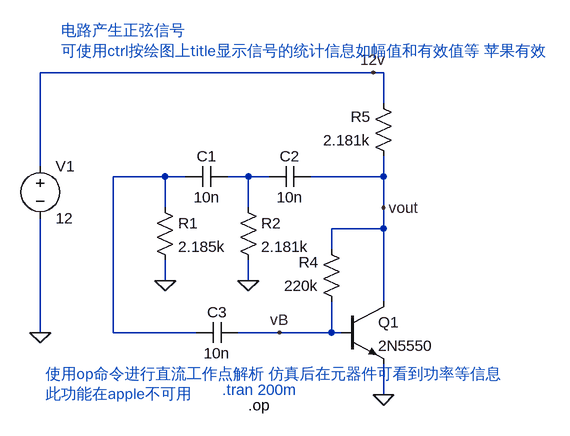
[diagram p0: schematic Draft1.asc]
Draft1.asc, the LTspice schematic file:
Version 4.1
SHEET 1 1076 680
WIRE 800 48 288 48
WIRE 816 48 800 48
WIRE 816 96 816 48
WIRE 288 192 288 48
WIRE 480 208 400 208
WIRE 512 208 480 208
WIRE 608 208 576 208
WIRE 640 208 608 208
WIRE 816 208 816 176
WIRE 816 208 704 208
WIRE 480 256 480 208
WIRE 608 256 608 208
WIRE 816 256 816 208
WIRE 816 288 816 256
WIRE 816 288 736 288
WIRE 736 320 736 288
WIRE 480 368 480 336
WIRE 608 368 608 336
WIRE 816 400 816 288
WIRE 288 448 288 272
WIRE 400 448 400 208
WIRE 528 448 400 448
WIRE 656 448 592 448
WIRE 736 448 736 400
WIRE 736 448 656 448
WIRE 752 448 736 448
WIRE 816 544 816 496
FLAG 288 448 0
FLAG 480 368 0
FLAG 608 368 0
FLAG 816 544 0
FLAG 800 48 12v
FLAG 656 448 vB
FLAG 816 256 vout
SYMBOL Voltage 288 176 R0
SYMATTR InstName V1
SYMATTR Value 12
SYMBOL Res 464 240 R0
SYMATTR InstName R1
SYMATTR Value 2.185k
SYMBOL Res 592 240 R0
SYMATTR InstName R2
SYMATTR Value 2.181k
SYMBOL Cap 576 192 R90
WINDOW 0 0 32 VBottom 2
WINDOW 3 32 32 VTop 2
SYMATTR InstName C1
SYMATTR Value 10n
SYMBOL Cap 704 192 R90
WINDOW 0 0 32 VBottom 2
WINDOW 3 32 32 VTop 2
SYMATTR InstName C2
SYMATTR Value 10n
SYMBOL Res 752 416 R180
WINDOW 0 36 76 Left 2
WINDOW 3 36 40 Left 2
SYMATTR InstName R4
SYMATTR Value 220k
SYMBOL Res 832 192 R180
WINDOW 0 36 76 Left 2
WINDOW 3 36 40 Left 2
SYMATTR InstName R5
SYMATTR Value 2.181k
SYMBOL npn 752 400 R0
SYMATTR InstName Q1
SYMATTR Value 2N5550
SYMBOL Cap 592 432 R90
WINDOW 0 0 32 VBottom 2
WINDOW 3 32 32 VTop 2
SYMATTR InstName C3
SYMATTR Value 10n
TEXT 568 536 Left 2 ;.tran 200m
TEXT 296 512 Left 2 ;使用op命令进行直流工作点解析 仿真后在元器件可看到功率等信息\n此功能在apple不可用
TEXT 320 -16 Left 2 ;电路产生正弦信号\n可使用ctrl按绘图上title显示信号的统计信息如幅值和有效值等 苹果有效
TEXT 608 560 Left 2 !.op

The netlist it stands for:
* Draft1.asc
V1 12v 0 12
R1 N001 0 2.185k
R2 N002 0 2.181k
C1 N002 N001 10n
C2 vout N002 10n
R4 vB vout 220k
R5 vout 12v 2.181k
Q1 vout vB 0 0 2N5550
C3 vB N001 10n
.model NPN NPN
.model PNP PNP
.lib standard.bjt
* .tran 200m
* 使用op命令进行直流工作点解析 仿真后在元器件可看到功率等信息
* 此功能在apple不可用
* 电路产生正弦信号
* 可使用ctrl按绘图上title显示信号的统计信息如幅值和有效值等 苹果有效
.op
.backanno
.end